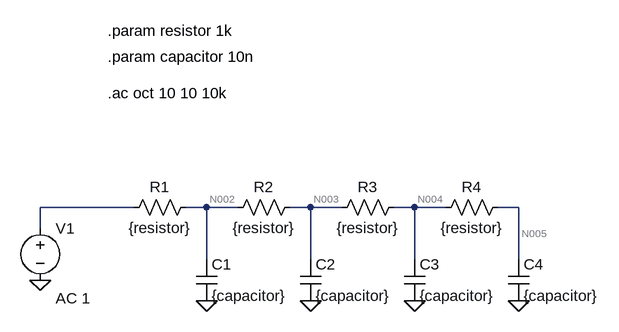
[diagram p0: schematic Draft2.asc]
Draft2.asc, the LTspice schematic file:
Version 4
SHEET 1 880 680
WIRE 128 96 -16 96
WIRE 240 96 208 96
WIRE 288 96 240 96
WIRE 400 96 368 96
WIRE 448 96 400 96
WIRE 560 96 528 96
WIRE 608 96 560 96
WIRE 720 96 688 96
WIRE -16 128 -16 96
WIRE 240 176 240 96
WIRE 400 176 400 96
WIRE 560 176 560 96
WIRE 720 176 720 96
FLAG -16 208 0
FLAG 240 240 0
FLAG 400 240 0
FLAG 560 240 0
FLAG 720 240 0
SYMBOL voltage -16 112 R0
WINDOW 123 24 124 Left 2
WINDOW 39 0 0 Left 0
SYMATTR InstName V1
SYMATTR Value ""
SYMATTR Value2 AC 1
SYMBOL res 224 80 R90
WINDOW 0 0 56 VBottom 2
WINDOW 3 32 56 VTop 2
SYMATTR InstName R1
SYMATTR Value {resistor}
SYMBOL res 384 80 R90
WINDOW 0 0 56 VBottom 2
WINDOW 3 32 56 VTop 2
SYMATTR InstName R2
SYMATTR Value {resistor}
SYMBOL res 544 80 R90
WINDOW 0 0 56 VBottom 2
WINDOW 3 32 56 VTop 2
SYMATTR InstName R3
SYMATTR Value {resistor}
SYMBOL cap 224 176 R0
SYMATTR InstName C1
SYMATTR Value {capacitor}
SYMBOL cap 384 176 R0
SYMATTR InstName C2
SYMATTR Value {capacitor}
SYMBOL cap 544 176 R0
SYMATTR InstName C3
SYMATTR Value {capacitor}
SYMBOL res 704 80 R90
WINDOW 0 0 56 VBottom 2
WINDOW 3 32 56 VTop 2
SYMATTR InstName R4
SYMATTR Value {resistor}
SYMBOL cap 704 176 R0
SYMATTR InstName C4
SYMATTR Value {capacitor}
TEXT 88 -176 Left 2 !.param resistor 1k
TEXT 88 -136 Left 2 !.param capacitor 10n
TEXT 88 -80 Left 2 !.ac oct 10 10 10k

The netlist it stands for:
* Draft2.asc
V1 N001 0 AC 1
R1 N002 N001 {resistor}
R2 N003 N002 {resistor}
R3 N004 N003 {resistor}
C1 N002 0 {capacitor}
C2 N003 0 {capacitor}
C3 N004 0 {capacitor}
R4 N005 N004 {resistor}
C4 N005 0 {capacitor}
.param resistor 1k
.param capacitor 10n
.ac oct 10 10 10k
.backanno
.end

* Results of the author's LTspice run, read from the files saved beside the schematic
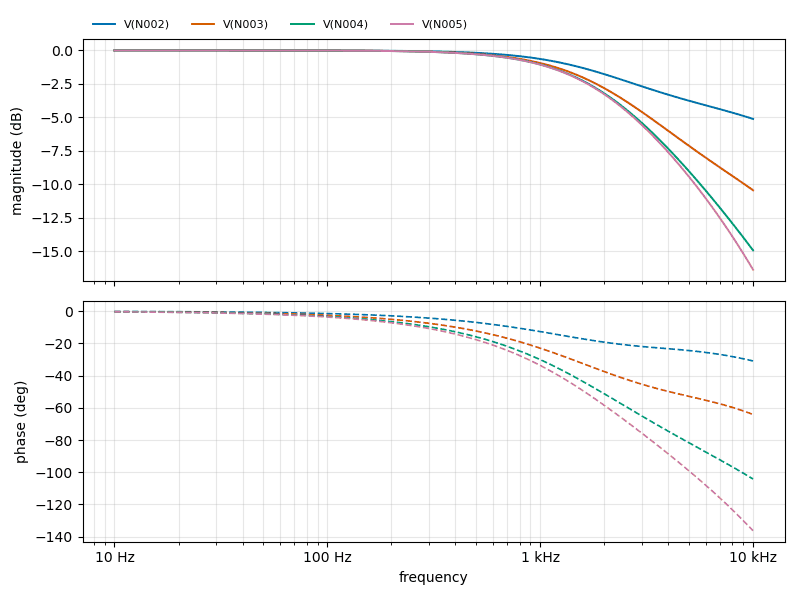
[diagram p1: AC Analysis of Draft2.asc, plotted from the saved traces]
* AC Analysis, 1 run:
*   V(N002): -0.00 dB at 10 Hz, -5.12 dB at 10 kHz, peak -0.00 dB at 10 Hz, 3 dB below the peak at 3.478 kHz
*   V(N003): -0.00 dB at 10 Hz, -10.44 dB at 10 kHz, peak -0.00 dB at 10 Hz, 3 dB below the peak at 2.099 kHz
*   V(N004): -0.00 dB at 10 Hz, -14.93 dB at 10 kHz, peak -0.00 dB at 10 Hz, 3 dB below the peak at 1.912 kHz
*   V(N005): -0.00 dB at 10 Hz, -16.37 dB at 10 kHz, peak -0.00 dB at 10 Hz, 3 dB below the peak at 1.885 kHz